# EAGLE design OSO-MISC-20-015 Vitals Board for Ring (EAGLE 9.6.2)
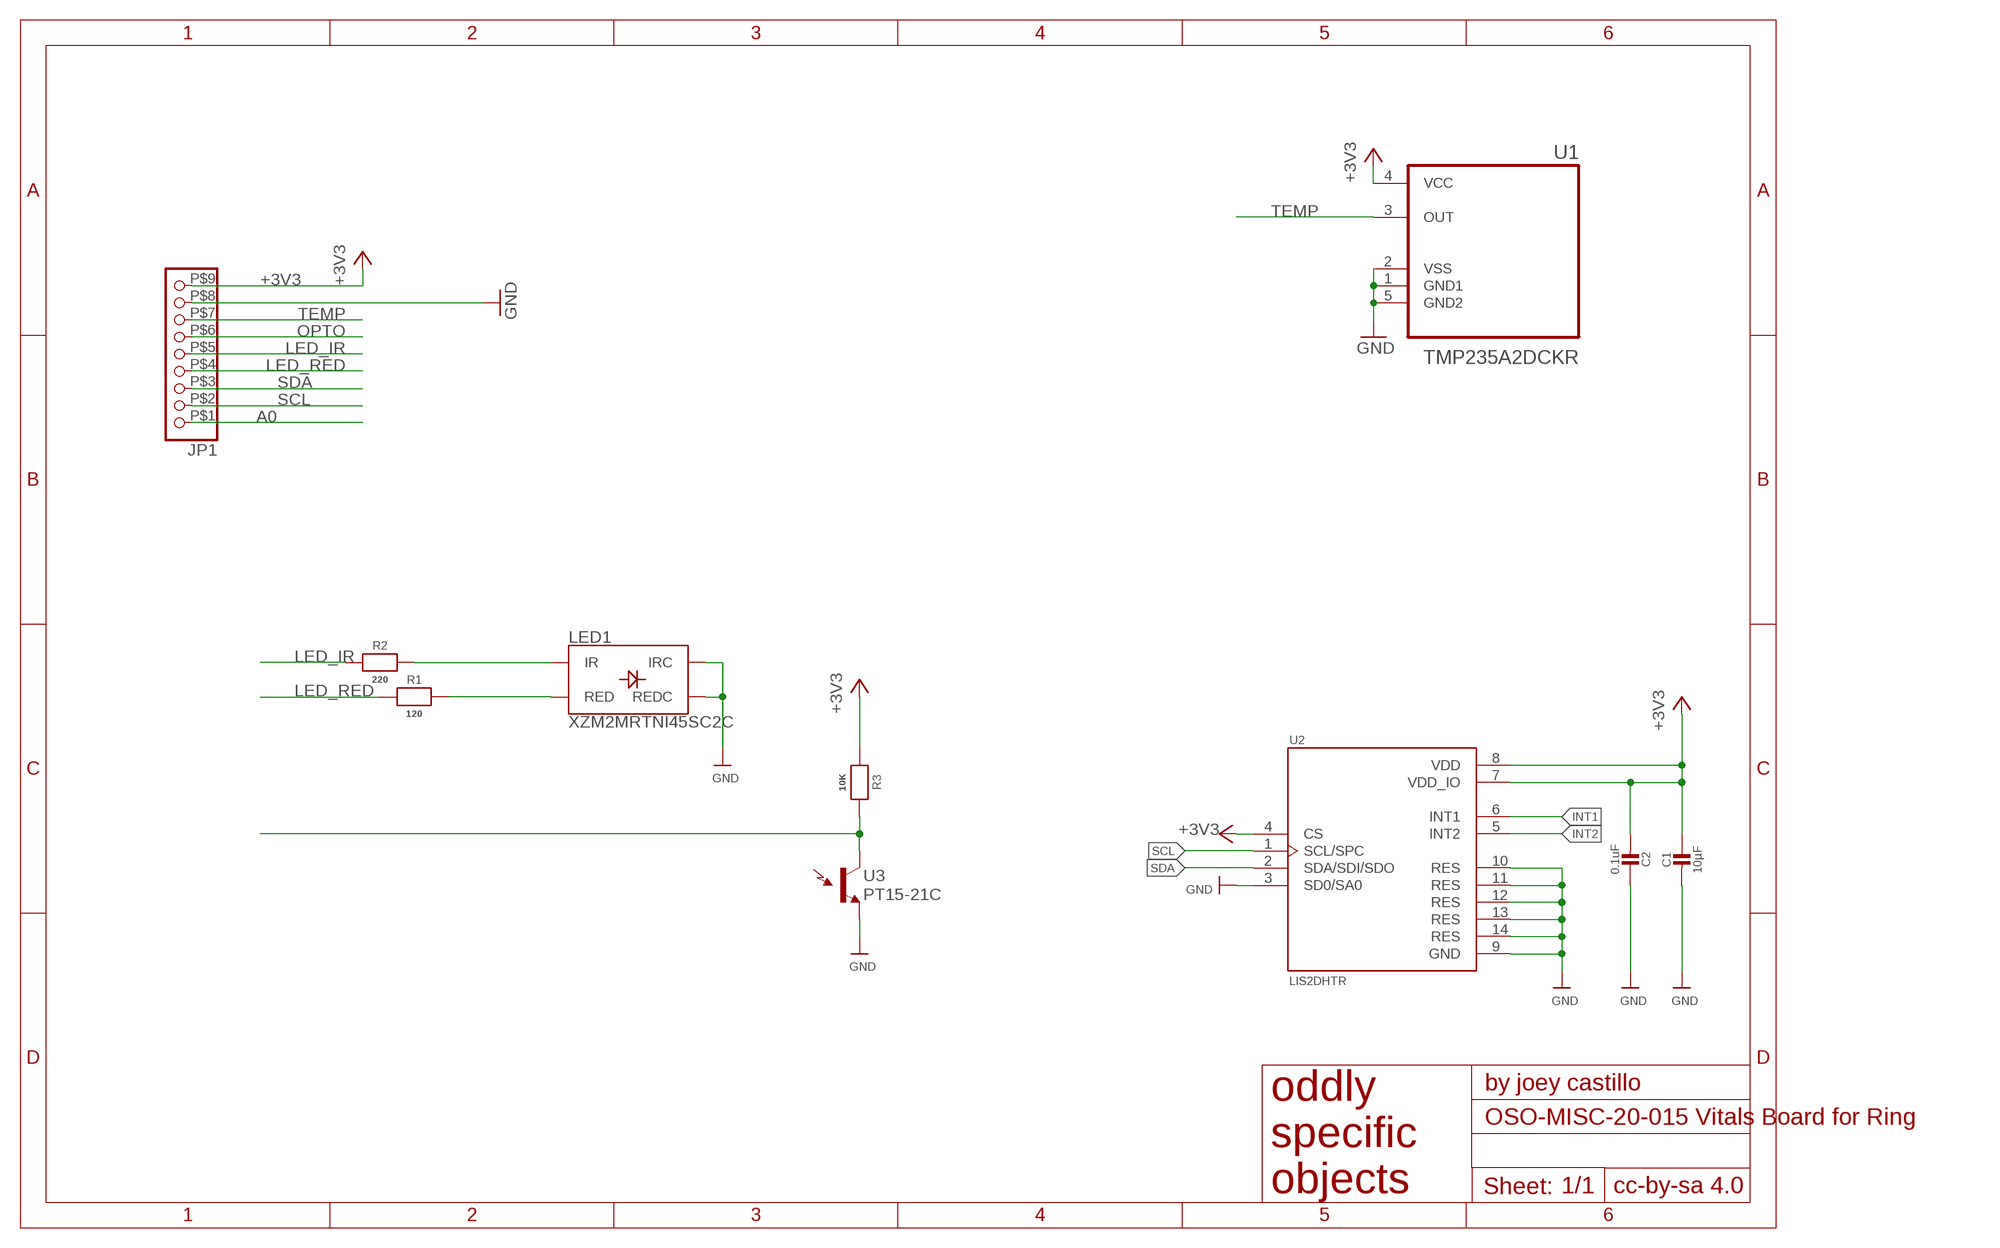
[diagram p0: schematic, sheet 1]

## Parts
C1  10µF  CAP_CERAMIC0603_NO  [0603-NO]
C2  0.1uF  CAP_CERAMIC0603_NO  [0603-NO]
JP1  HEADER-1X9BOARD_TO_FLEX  [9PIN_SMT_CONNECTOR]
LED1  XZM2MRTNI45SC2C  SUNLED_DUAL_RED_IRSMD1  [PLCC4SMDLED]
R1  120  RESISTOR_0603_NOOUT  [0603-NO]
R2  220  RESISTOR_0603_NOOUT  [0603-NO]
R3  10K  RESISTOR_0603_NOOUT  [0603-NO]
U1  TMP235A2DCKR  [SOT65P210X110-5N]
U2  LIS2DHTR  [PQFN35P200X200X100-14N]
U3  PT15-21C  LIGHT_SENSOR1206  [LED-1206]

## Nets
+3V3: C1.1 C2.2 JP1.P$9 R3.1 U1.4(VCC) U2.4(CS) U2.7(VDD_IO) U2.8(VDD)
A0: JP1.P$1
GND: C1.2 C2.1 JP1.P$8 LED1.1(REDC) LED1.3(IRC) U1.1(GND1) U1.2(VSS) U1.5(GND2) U2.3(SD0/SA0) U2.9(GND) U2.10(RES) U2.11(RES) U2.12(RES) U2.13(RES) U2.14(RES) U3.C(E1)
INT1: U2.6(INT1)
INT2: U2.5(INT2)
IR_LIM: LED1.4(IR) R2.2
LED_IR: JP1.P$5 R2.1
LED_RED: JP1.P$4 R1.1
OPTO: JP1.P$6 R3.2 U3.A(C1)
RED_LIM: LED1.2(RED) R1.2
SCL: JP1.P$2 U2.1(SCL/SPC)
SDA: JP1.P$3 U2.2(SDA/SDI/SDO)
TEMP: JP1.P$7 U1.3(OUT)

## Library data of the parts
C1 C2 = microbuilder:CAP_CERAMIC: Ceramic Capacitors For new designs, use the packages preceded by an '_' character since they are more reliable: The following footprints should be used on most boards: _0402 - Standard footprint for regular board layouts _0603 - Standard footprint for regular board layouts _0805 - Standard footprint for regular board layouts _1206 - Standard footprint for regular board layouts For extremely tight-pitch boards where space is at a premium, the following 'micro-pitch' footprints can be used (smaller pads, no silkscreen outline, etc.): _0402MP - Micro-pitch footprint for very dense/compact boards _0603MP - Micro-pitch footprint for very dense/compact boards _0805MP - Micro-pitch footprint for very dense/compact boards _1206MP - Micro-pitch footprint for very dense/compact boards
JP1 = My Stuff:HEADER-1X9: PIN HEADER
LED1 = My Stuff:SUNLED_DUAL_RED_IR: LED-RGB Common Cathode XZM2CRKM2DGFBB45SCCB Packages: PLCC4 SparkFun Products: Lilypad Prototyping Board <[https://www.sparkfun.com/products/9264]>; PROD_ID: DIO-13722; VALUE: XZM2CRKM2DGFBB45SCCB
R1-R3 = microbuilder:RESISTOR: Resistors For new designs, use the packages preceded by an '_' character since they are more reliable: The following footprints should be used on most boards: _0402 - Standard footprint for regular board layouts _0603 - Standard footprint for regular board layouts _0805 - Standard footprint for regular board layouts _1206 - Standard footprint for regular board layouts For extremely tight-pitch boards where space is at a premium, the following 'micro-pitch' footprints can be used (smaller pads, no silkscreen outline, etc.): _0402MP - Micro-pitch footprint for very dense/compact boards _0603MP - Micro-pitch footprint for very dense/compact boards _0805MP - Micro-pitch footprint for very dense/compact boards _1206MP - Micro-pitch footprint for very dense/compact boards
U1 = TMP235A2DCKR:TMP235A2DCKR; DESCRIPTION: 1.2C 2.3V to 5.5V analog output temperature sensor with -13.6 mV/C gain 5-SC70 -40 to 150; DIGI-KEY_PART_NUMBER: 296-50494-1-ND; MF: Texas Instruments; MP: TMP235A2DCKR; PACKAGE: SOT-SC70-5 Texas Instruments; PURCHASE-URL: https://pricing.snapeda.com/search/part/TMP235A2DCKR/?ref=eda
U2 = LIS2DHTR:LIS2DHTR: MEMS digital output motion sensor: ultra low-power high performance 3-axes femto accelerometer; DESCRIPTION: Accelerometer X, Y, Z Axis ±2g, 4g, 8g, 16g 0.5Hz ~ 672Hz 14-LGA _2x2_; DIGI-KEY_PART_NUMBER: 497-13795-1-ND; DIGI-KEY_PURCHASE_URL: https://www.digikey.com/product-detail/en/stmicroelectronics/LIS2DHTR/497-13795-1-ND/4209308?utm_source=snapeda&utm_medium=aggregator&utm_campaign=symbol; MF: STMicroelectronics; MP: LIS2DHTR; PACKAGE: LGA-14 STMicroelectronics
U3 = SparkFun-Sensors:LIGHT_SENSOR: Ambient Light Sensors - Phototransistors Low cost ambient light sensors, consisting of a phototransistor in miniature SMD packages. Output voltage varies with light intensity. SparkFun Products ALS-PT19 Light Sensor <https://www.sparkfun.com/products/12566> (SEN-12566) Ambient Light Sensor - TEMT6000 <https://www.sparkfun.com/products/8348> (SEN-08348) SparkFun Ambient Light Sensor Breakout - TEMT60000 <https://www.sparkfun.com/products/8688> (SEN-08688)

## Net classes
1 power: width 0.305 mm

## Board
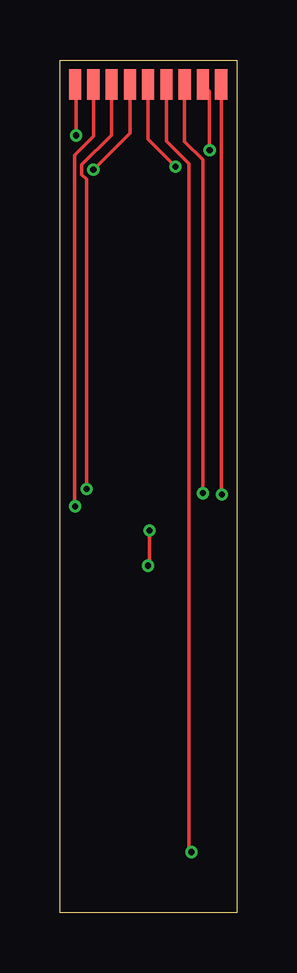
[diagram p1: board, top side]
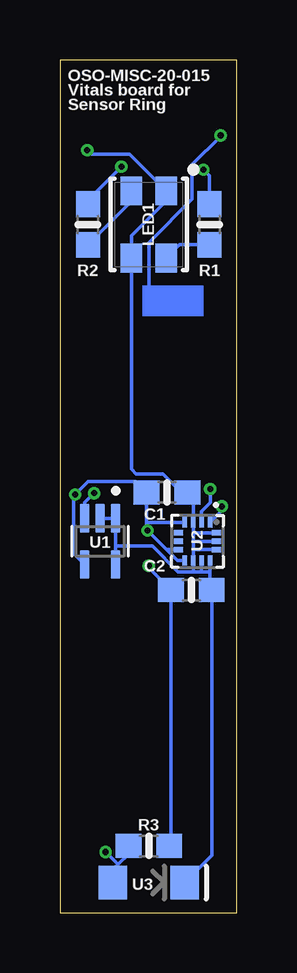
[diagram p2: board, bottom side, seen from below]

Size 7.39 x 35.56 mm. Coordinates in mm from the lower left corner, seen from the top.
Outline: 7.39,35.56 7.39,0 0,0 0,35.56 7.39,35.56
Copper layers (1*16): Top 0.035559375mm / dielectric 1.6mm / Bottom 0.035559375mm
Design rules "oshpark-2layer *": minimum track width 6mil, minimum drill 10mil, track to track 6mil, track to pad 6mil, pad to pad 6mil, via to via 6mil, smd to smd 6mil, copper to edge 15mil, drill to drill 6mil, minimum pad ring 5mil, minimum via ring 5mil, stop-mask expansion 2.5mil, vias tented up to drill 12mil, thermal gap 10mil

### Footprints (pad centres in the part's own frame; a part is rotated, then mirrored left to right if it is on the bottom)
0603-NO = smd 1.075 x 1: 1 -0.85,0; 2 0.85,0
9PIN_SMT_CONNECTOR = smd 0.508 x 1.27: P$1 -3.048,0; P$2 -2.286,0; P$3 -1.524,0; P$4 -0.762,0; P$5 0,0; P$6 0.762,0; P$7 1.524,0; P$8 2.286,0; P$9 3.048,0
PLCC4SMDLED = smd 1.2 x 0.9: 1 -1.4,0.725; 2 1.4,0.725; 3 1.4,-0.725; 4 -1.4,-0.725
SOT65P210X110-5N = smd 1.19 x 0.4: 1 -0.96,0.65; 2 -0.96,0; 3 -0.96,-0.65; 4 0.96,-0.65; 5 0.96,0.65
PQFN35P200X200X100-14N = smd 0.39 x 0.2: 1 -0.795,0.525; 2 -0.795,0.175; 3 -0.795,-0.175; 4 -0.795,-0.525; 8 0.795,-0.525; 9 0.795,-0.175; 10 0.795,0.175; 11 0.795,0.525 | smd 0.2 x 0.39: 5 -0.35,-0.795; 6 0,-0.795; 7 0.35,-0.795; 12 0.35,0.795; 13 0,0.795; 14 -0.35,0.795
LED-1206 = smd 1.2 x 1.4: A -1.5,0; C 1.5,0

### Placement (x,y rotation side)
C1  2.92,17.53 0 bottom
C2  1.9,13.46 180 bottom
JP1  3.68,34.54 0 top
LED1  3.68,28.7 270 bottom
R1  1.14,28.7 270 bottom
R2  6.22,28.7 270 bottom
R3  3.68,2.79 180 bottom
U1  5.71,15.49 270 bottom
U2  1.65,15.49 270 bottom
U3  3.68,1.27 0 bottom

### Tracks (layer width: path | path; a pad name or v marks a point on that pad's centre or on a via)
+3V3  (via drill 0.25)
  Top 0.152: JP1.P$9 6.73,17.48 v6.76,17.45 | v3.74,15.95 3.74,14.53 v3.68,14.48
  Bottom 0.152: U1.4 6.82,14.99 6.82,17.39 v6.76,17.45 6.22,17.98 4.23,17.98 C1.1 3.77,16.26 | U2.7 2.94,15.14 | 3.77,16.26 3.77,15.98 v3.74,15.95 2.94,15.14 | U2.4 3.74,16.29 3.77,16.26 | 2.94,15.14 2.49,14.7 U2.8 | v3.68,14.48 3.68,14.39 C2.2 2.75,2.87 R3.1
A0  (via drill 0.25)
  Top 0.152: JP1.P$1 0.68,34.5 v0.68,32.41
  Bottom 0.152: v0.68,32.41 0.68,32.38 1.88,31.19 1.88,29.75 3.64,28 3.64,27.99 3.68,27.94 3.68,25.91 3.17,25.4
GND  (via drill 0.25)
  Top 0.152: JP1.P$8 6.25,34.27 v6.25,31.8
  Bottom 0.152: U1.2 U1.1 5.06,15.24 | 5.06,15.24 U1.5 | 5.06,15.24 5.01,15.3 3.54,15.3 2.46,14.22 1.83,14.22 | 1.48,14.22 1.13,14.22 | 1.83,14.22 U2.9 1.83,15.14 | U2.10 1.48,14.22 | U2.11 1.13,14.22 | 1.83,15.84 U2.3 1.83,17.28 C1.2 2.32,17.53 3.1,18.3 4.21,18.3 4.41,18.51 LED1.3 4.41,28.23 2.96,29.68 LED1.1 4.48,31.62 6.07,31.62 v6.25,31.8 | U2.13 1.83,15.49 | 1.48,14.22 1.83,14.22 | U2.14 1.83,15.84 | U2.12 1.83,15.14 | 1.83,15.84 1.83,15.49 | 1.83,15.14 1.83,15.49 | 1.13,14.22 1.13,13.53 C2.1 1.05,2.4 U3.C
IR_LIM
  Bottom 0.152: R2.2 4.41,29.67 LED1.4
LED_IR  (via drill 0.25)
  Top 0.152: JP1.P$5 3.68,32.25 v4.83,31.11
  Bottom 0.152: v4.83,31.11 6.22,29.71 R2.1
LED_RED  (via drill 0.25)
  Top 0.152: JP1.P$4 2.92,32.51 v1.4,30.99
  Bottom 0.152: v1.4,30.99 1.14,30.73 R1.1
OPTO  (via drill 0.25)
  Top 0.152: v5.49,2.54 5.38,2.64 5.38,31.24 4.45,32.18 JP1.P$6
  Bottom 0.152: U3.A 5.18,1.8 4.97,2.02 | 4.97,2.02 4.53,2.45 R3.2 | v5.49,2.54 4.97,2.02
RED_LIM
  Bottom 0.152: R1.2 2.41,27.85 LED1.2
SCL  (via drill 0.25)
  Top 0.152: JP1.P$2 1.4,32.38 0.61,31.59 0.61,16.98 v0.63,16.95
  Bottom 0.152: U2.1 0.63,16.78 v0.63,16.95
SDA  (via drill 0.25)
  Top 0.152: v1.12,17.68 1.12,30.59 0.91,30.79 0.91,31.19 2.16,32.43 JP1.P$3
  Bottom 0.152: v1.12,17.68 1.12,17.1 1.48,16.75 U2.2
TEMP  (via drill 0.25)
  Top 0.152: JP1.P$7 5.21,32.16 5.97,31.39 v5.97,17.5
  Bottom 0.152: v5.97,17.5 6.37,17.11 U1.3
(copper drawn outside any net)
  shapes: Bottom area x1

### Text on the board
bPlace: OSO-MISC-20-015 / Vitals board for / Sensor Ring